# Altium schematic sheet Master MicroController Port A.SchDoc: Master Micro Controller Port A Pin Out
size A4; DocumentNumber: 16; SheetNumber: 16; SheetTotal: 54
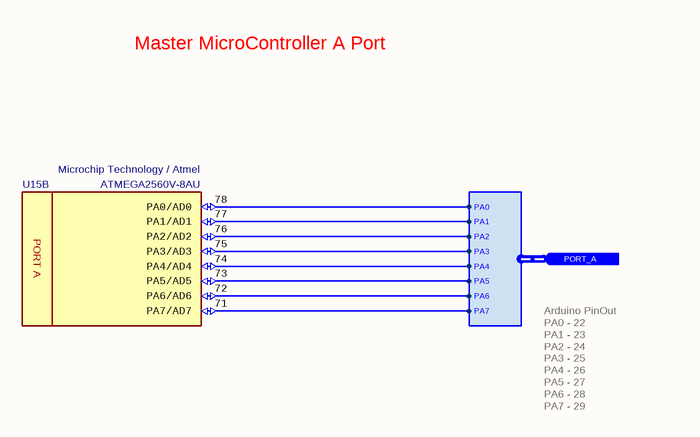
[diagram p0: Master MicroController Port A.SchDoc]

## Parts
U15  Manufacturer_Part_Number: ATMEGA2560V-8AU  Manufacturer_Name: Microchip Technology / Atmel  [TQFP100]  (hidden comment: 8-bit MicroController)  (part B of 15)

## Ports
PORT_A (in, harness PORT_A)

## Harnesses
PORT_A: PA0, PA1, PA2, PA3, PA4, PA5, PA7, PA6

## Nets
NetU15_71: U15.71(PA7/AD7) ; port PORT_A.PA7
NetU15_72: U15.72(PA6/AD6) ; port PORT_A.PA6
NetU15_73: U15.73(PA5/AD5) ; port PORT_A.PA5
NetU15_74: U15.74(PA4/AD4) ; port PORT_A.PA4
NetU15_75: U15.75(PA3/AD3) ; port PORT_A.PA3
NetU15_76: U15.76(PA2/AD2) ; port PORT_A.PA2
NetU15_77: U15.77(PA1/AD1) ; port PORT_A.PA1
NetU15_78: U15.78(PA0/AD0) ; port PORT_A.PA0

## Notes on the sheet
- Master MicroController A Port
- Arduino PinOut
  PA0 - 22
  PA1 - 23
  PA2 - 24
  PA3 - 25
  PA4 - 26
  PA5 - 27
  PA6 - 28
  PA7 - 29
- Engineer
- All Rights are reserved to Customer and Engineer. [2021]
- Size:
- Date:
- A4
- Project :
- Time:
- Sheet
- of
- Customer
- Product ID
- Module ID
- Version
- File:
- Revision
- (in symbol IC - ATMEGA2560V-8AU, part B) PORT A

## Library data of the parts
U15 = IC - ATMEGA2560V-8AU: 8-bit Microcontrollers - MCU 256kB Flash 4kB EEPROM 86 I/O Pins; Supply Voltage - Min: 2V7; Supply Voltage - Max: 5.5V; Height: 1mm; Mouser_Part_Number: 556-ATMEGA2560V8AU; ComponentLink1Description: DataSheet; ComponentLink1URL: https://eu.mouser.com/datasheet/2/268/Atmel-2549-8-bit-AVR-Microcontroller-ATmega640-128-1315286.pdf; ROHS: Yes; Minimum Operating Temperature: -40; Maximum Operating Temperature: +85; ComponentLink2Description: Mouser; ComponentLink2URL: https://eu.mouser.com/ProductDetail/Microchip-Technology-Atmel/ATMEGA2560V-8AU?qs=sGAEpiMZZMutXGli8Ay4kKlCYcvZUWqJYdtgGFyqFT8%3D; Supplier 1: Mouser; Supplier 2: Arrow; Supplier 3: Farnell; Supplier 4: Newark; Supplier 5: Digi-Key; Supplier Part Number 1: 556-ATMEGA2560V8AU; Supplier Part Number 2: ATMEGA2560V-8AU; Supplier Part Number 3: 1288331; Supplier Part Number 4: 68T2784; Supplier Part Number 5: ATMEGA2560V-8AU-ND; Case: TQFP-100